# EAGLE design IOB-Turtle (EAGLE 7.7.0)
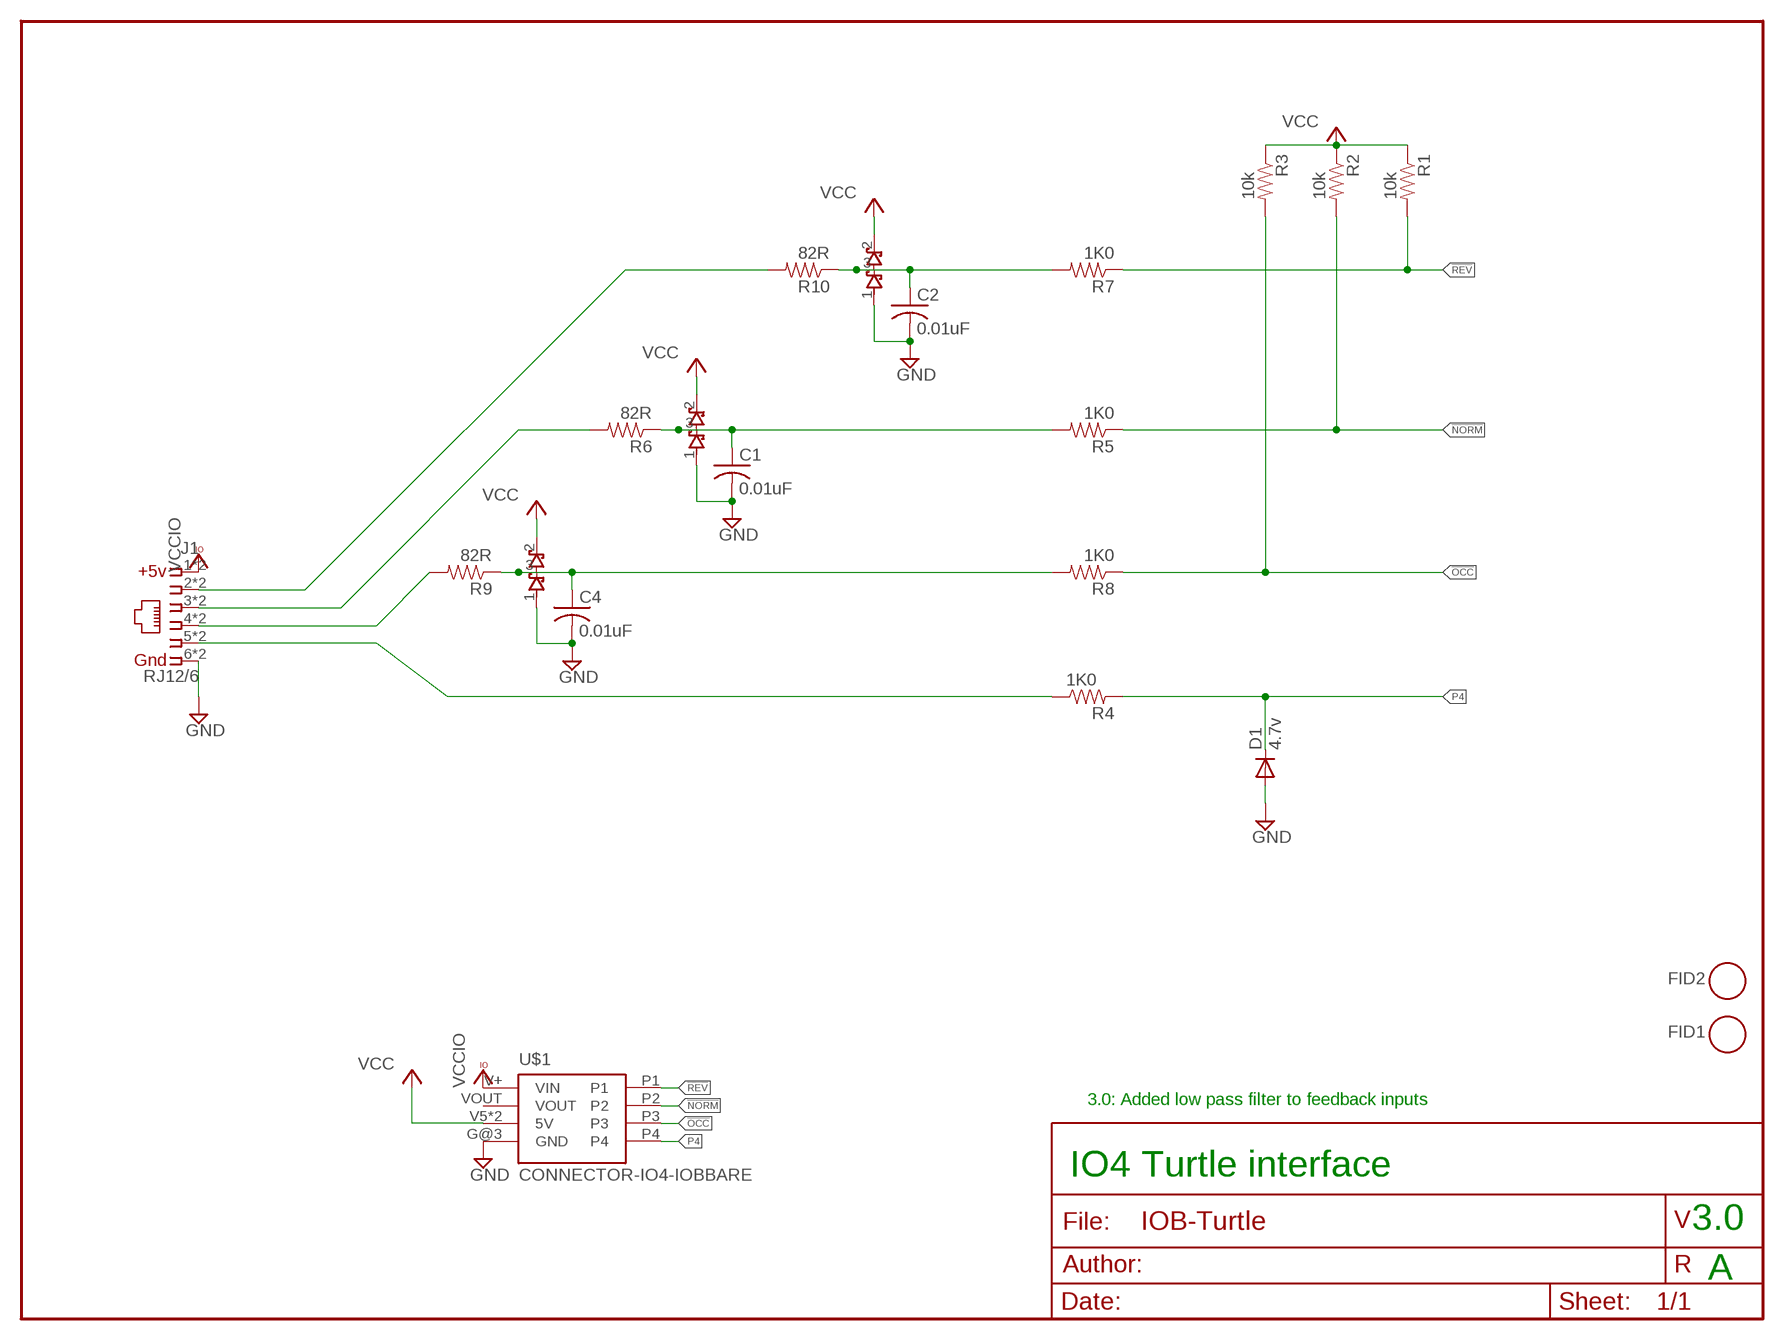
[diagram p0: schematic, sheet 1]

## Parts
C1  0.01uF  CAP0603  [0603-CAP]
C2  0.01uF  CAP0603  [0603-CAP]
C4  0.01uF  CAP0603  [0603-CAP]
D1  4.7v  DIODESOT23  [SOT23-3]
D2  BAT54S  DIODE-BAT54S23  [SOT23]
D3  BAT54S  DIODE-BAT54S23  [SOT23]
D4  BAT54S  DIODE-BAT54S23  [SOT23]
FID1  FIDUCIAL  [FIDUCIAL_1MM]
FID2  FIDUCIAL  [FIDUCIAL_1MM]
J1  RJ12/6  CONNECTOR-IO4IPINS  [RJ24-INVERTED-PINS]
R1  10k  R0805-RES  [0805-RES]
R2  10k  R0805-RES  [0805-RES]
R3  10k  R0805-RES  [0805-RES]
R4  1K0  R0603-RES  [0603-RES]
R5  1K0  R0603-RES  [0603-RES]
R6  82R  R0805-RES  [0805-RES]
R7  1K0  R0603-RES  [0603-RES]
R8  1K0  R0603-RES  [0603-RES]
R9  82R  R0805-RES  [0805-RES]
R10  82R  R0805-RES  [0805-RES]
U$1  CONNECTOR-IO4-IOBBARE  [IO4-IOB]

## Nets
!NORM [signals]: R2.2 R5.1 U$1.P2
!OCC [signals]: R3.2 R8.1 U$1.P3
!REV [signals]: R1.2 R7.1 U$1.P1
GND [Power]: C1.2 C2.2 C4.2 D1.1(A) D2.1(A1) D3.1(A1) D4.1(A1) J1.6 J1.6@1 U$1.G@3(GND)
IO4-2 [signals]: J1.2 J1.2@1 R10.2
IO4-3 [signals]: J1.3 J1.3@1 R6.2
IO4-5 [signals]: J1.5 J1.5@1 R4.1
N$1: J1.4 J1.4@1 R9.2
N$2: C1.1 D2.3(COM) R5.2 R6.1
N$3: C2.1 D3.3(COM) R7.2 R10.1
N$14: C4.1 D4.3(COM) R8.2 R9.1
P4 [signals]: D1.3(C) R4.2 U$1.P4
VCC: D2.2(C2) D3.2(C2) D4.2(C2) R1.1 R2.1 R3.1 U$1.V5(5V) U$1.V5@1(5V)
VCCIO: J1.1 J1.1@1 U$1.V+(VIN)
Unconnected: U$1.VOUT

## Notes on the sheet
- 3.0: Added low pass filter to feedback inputs
- IO4 Turtle interface
- 3.0
- A

## Library data of the parts
C1 C2 C4 = SPCoast:CAP*
D1 = SPCoast:DIODE: Diode These are standard reverse protection diodes and small signal diodes. SMA package can handle up to about 1A. SOD-323 can handle about 200mA. What the SOD-323 package when ordering, there are some mfgs out there that are 5-pin packages.
D2-D4 = SPCoast:DIODE-BAT54S
FID1 FID2 = SPCoast:FIDUCIAL: For use by pick and place machines to calibrate the vision/machine, 1mm By microbuilder.eu
J1 = SPCoast:CONNECTOR-IO4
R1-R10 = SPCoast:R*: Resistor Basic schematic elements and footprints for 0603, 1206, and PTH 1/10th watt (small) resistors.
U$1 = SPCoast:CONNECTOR-IO4-IOB

## Net classes
0 default: width 0.254 mm, drill 0.4 mm, clearance 0.102 mm
1 Power: width 0.254 mm, drill 0.4 mm, clearance 0.102 mm
2 signals: width 0.254 mm, drill 0.4 mm, clearance 0.102 mm

## Board
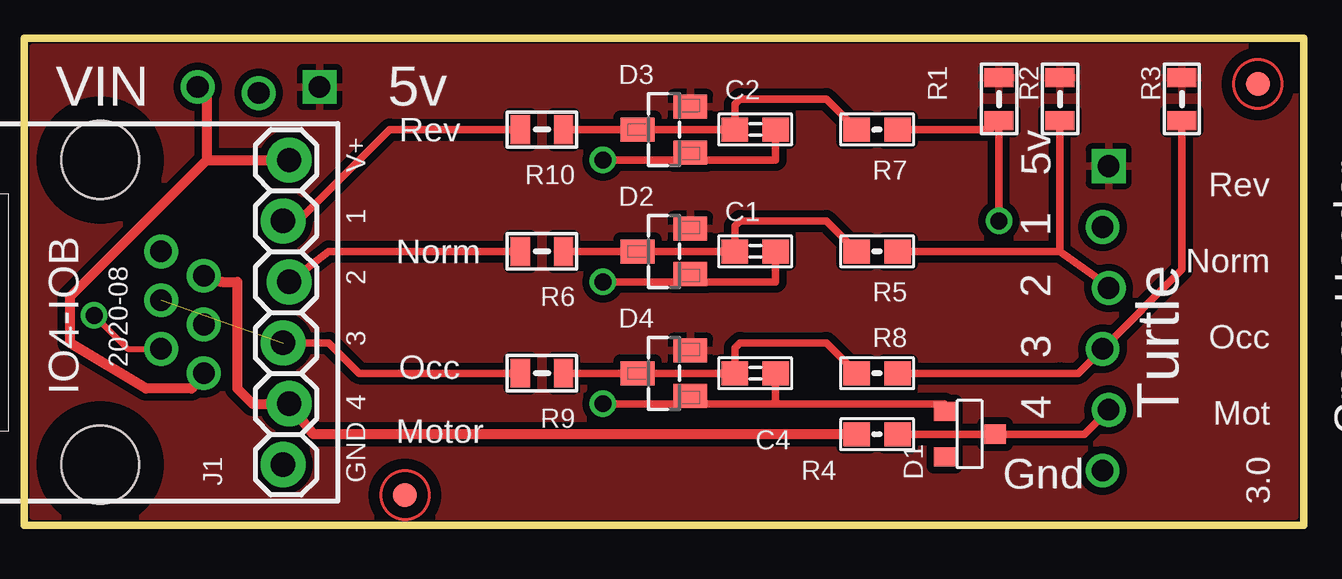
[diagram p1: board, top side]
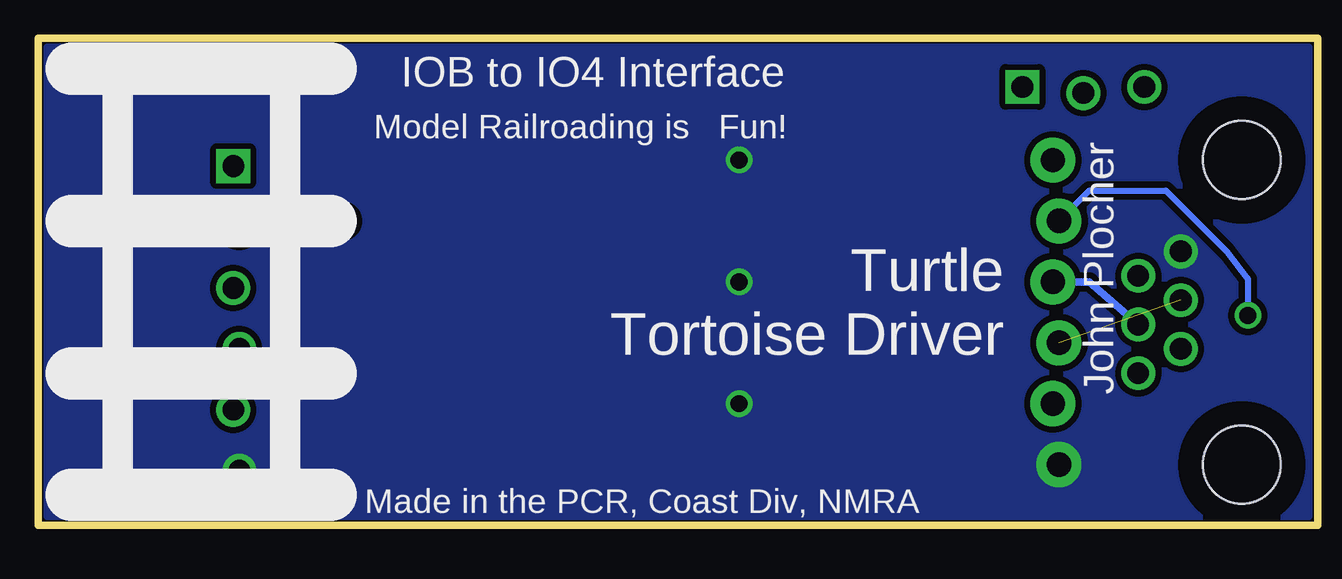
[diagram p2: board, bottom side, seen from below]

No outline drawn. Coordinates in mm, seen from the top.
Copper layers (1*16): Top 0.035mm / dielectric 1.5mm / Bottom 0.035mm
Design rules "default *": minimum track width 10mil, minimum drill 24mil, track to track 5mil, track to pad 8mil, pad to pad 8mil, via to via 8mil, smd to smd 8mil, copper to edge 40mil, drill to drill 8mil, minimum pad ring 10mil, minimum via ring 8mil, stop-mask expansion 4mil, vias tented up to drill 0mil, thermal gap 10mil
Milling: 4 lines

### Footprints (pad centres in the part's own frame; a part is rotated, then mirrored left to right if it is on the bottom)
0603-CAP = smd 1.1 x 1: 1 -0.85,0; 2 0.85,0
SOT23-3 = smd 0.9 x 0.8: 1 1,-0.95; 2 1,0.95; 3 -1.1,0
SOT23 = smd 1.4 x 1: 1 1.1,-0.95; 2 1.1,0.95; 3 -1.1,0
FIDUCIAL_1MM = smd 1 x 1: 1 0,0
RJ24-INVERTED-PINS = drill 1.016 pad 1.88: 1 6.35,-4.064; 2 3.81,-3.81; 3 1.27,-4.064; 4 -1.27,-3.81; 5 -3.81,-4.064; 6 -6.35,-3.81 | drill 0.9 pad 1.4: 1@1 -2.54,-0.508; 2@1 -1.524,1.27; 3@1 -0.508,-0.508; 4@1 0.508,1.27; 5@1 1.524,-0.508; 6@1 2.54,1.27 | hole 3.251: 6.35,3.81; -6.35,3.81
0805-RES = smd 0.8 x 1.2: 1 -0.9,0; 2 0.9,0
0603-RES = smd 1.1 x 1: 1 -0.85,0; 2 0.85,0
IO4-IOB = drill 0.9: G@3 44.958,2.286; P1 44.958,12.446; P2 45.212,9.906; P3 44.958,7.366; P4 45.212,4.826; V+ 7.239,18.288; VOUT 9.779,18.034 | drill 0.9 square: V5 12.319,18.288; V5@1 45.212,14.986

### Placement (x,y rotation side)
C1  30.48,11.43 0 top
C2  30.48,16.51 0 top
C4  30.48,6.35 0 top
D1  39.37,3.81 180 top
D2  26.67,11.43 0 top
D3  26.67,16.51 0 top
D4  26.67,6.35 0 top
FID1  15.88,1.27 0 top
FID2  51.44,18.41 0 top
J1  6.99,8.89 90 top
R1  40.64,17.78 270 top
R2  43.18,17.78 270 top
R3  48.26,17.78 270 top
R4  35.56,3.81 0 top
R5  35.56,11.43 180 top
R6  21.59,11.43 180 top
R7  35.56,16.51 180 top
R8  35.56,6.35 180 top
R9  21.59,6.35 180 top
R10  21.59,16.51 180 top
U$1  0,0 0 top

### Tracks (layer width: path | path; a pad name or v marks a point on that pad's centre or on a via)
!NORM
  Top 0.305: R5.1 43.18,11.43 | 43.18,11.43 R2.2 | 43.18,11.43 44.96,10.16 U$1.P2
!OCC
  Top 0.305: R8.1 43.18,6.35 43.94,6.35 U$1.P3 48.26,10.67 R3.2
!REV  (via drill 0.7)
  Top 0.305: v40.64,12.7 R1.2 40.27,16.51 R7.1
  Bottom 0.305: v40.64,12.7 44.7,12.7 U$1.P1
GND  (via drill 0.7)
  Top 0.305: 28.09,5.08 D4.1 27.79,5.08 | 31.75,5.08 38.1,5.08 38.37,5.08 D1.1 | 27.79,5.08 31.11,5.08 31.75,5.08 | v24.13,10.16 27.77,10.16 D2.1 27.94,10.16 31.11,10.16 31.33,10.16 C1.2 | v24.13,15.24 27.77,15.24 D3.1 27.94,15.24 31.11,15.24 31.33,15.24 C2.2 | 27.79,5.08 v24.13,5.08 | C4.2 31.33,5.08 31.75,5.08
  pour Bottom (isolate 0.254, no thermals): 0.38,0.38 0.38,19.94 52.96,19.94 52.96,0.38
IO4-2  (via drill 0.7)
  Top 0.254: v2.92,8.76 4.32,7.37 J1.2@1
  Top 0.305: J1.2 11.43,12.7 15.24,16.51 R10.2
  Bottom 0.254: J1.2 9.53,13.97 6.35,13.97 3.81,11.43 2.92,10.29 v2.92,8.76
IO4-3
  Top 0.305: J1.3 12.7,11.43 R6.2
  Bottom 0.305: J1.3@1 9.53,10.16 J1.3
IO4-5
  Top 0.406: R4.1 12.06,3.81 J1.5 9.53,5.08 8.89,5.71 8.89,10.16 8.26,10.16 J1.5@1
N$1  (1 unrouted)
  Top 0.305: J1.4 12.7,7.62 13.97,6.35 R9.2
N$2
  Top 0.305: R6.1 D2.3 C1.1 29.63,12.48 29.84,12.7 33.44,12.7 R5.2
N$3
  Top 0.305: R10.1 D3.3 C2.1 29.63,17.57 29.84,17.78 33.44,17.78 R7.2
N$14
  Top 0.305: R9.1 D4.3 C4.1 29.63,7.41 29.84,7.62 33.44,7.62 R8.2
P4
  Top 0.305: R4.2 D1.3 44.2,3.81 U$1.P4
VCC
  pour Top (isolate 0.305): 0.38,0.38 0.38,19.94 52.96,19.94 52.96,0.38
VCCIO
  Top 0.406: J1.1@1 6.99,5.71 5.08,5.71 1.91,7.62 1.91,9.53 3.81,11.43 7.62,15.24 | 7.62,15.24 J1.1 | U$1.V+ 7.62,17.78 7.62,15.24

### Text on the board
tPlace: Rev | Rev | Norm | Norm | Occ | 2020-08 | Occ | IO4-IOB | Mot | Turtle | Green Header | Green Soldermask / White Silkscreen | Motor | 3.0
bPlace: John Plocher | Turtle / Tortoise Driver
_tNames: R1 | R2 | R3 | D3 | C2 | R10 | R7 | D2 | C1 | R6 | R5 | D4 | R8 | R9 | C4 | J1 | R4 | D1